# EAGLE design RGBS_to_YPbPr (EAGLE 9.6.2)
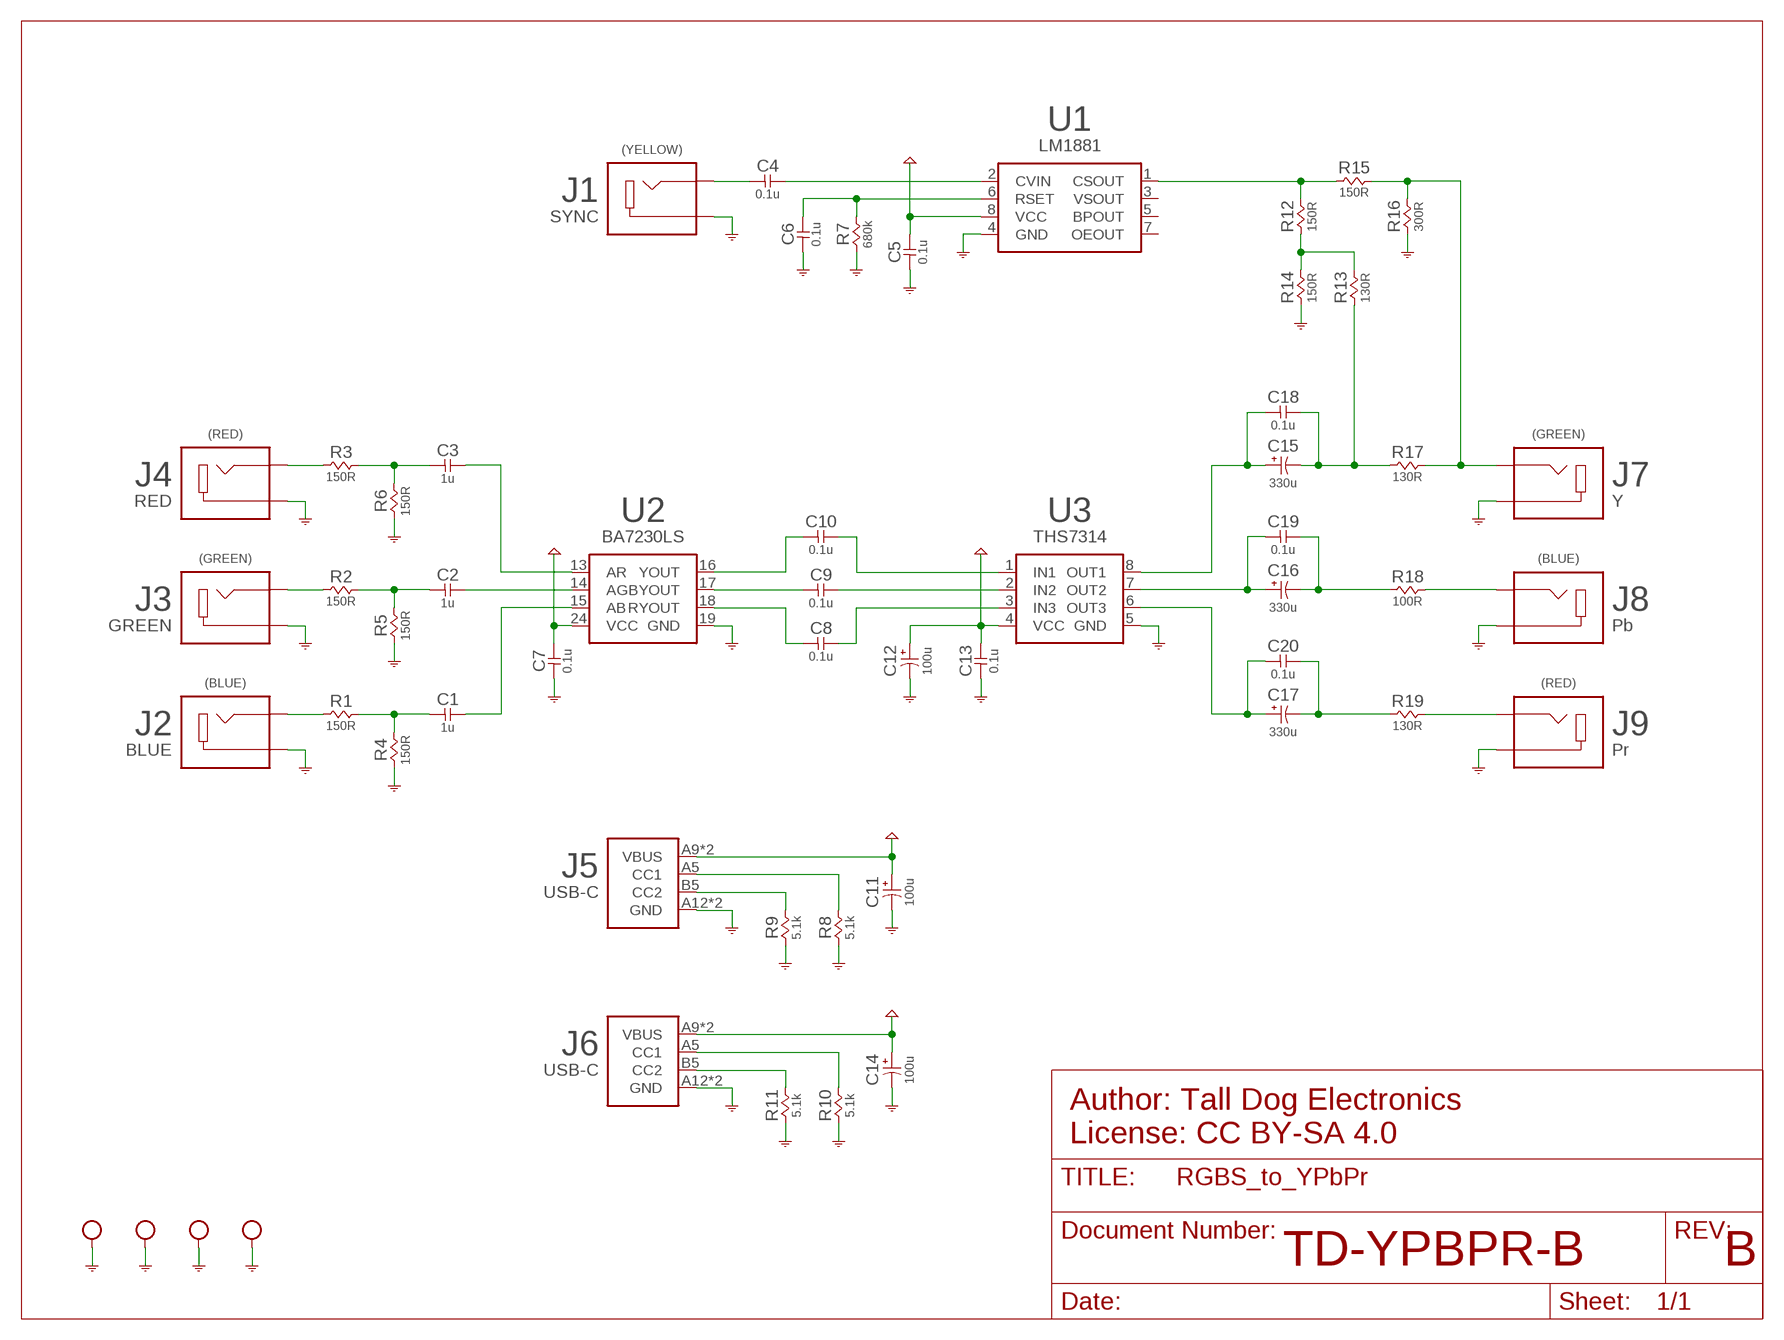
[diagram p0: schematic, sheet 1]

## Parts
C1  1u  CAP-NP-0805  [0805-NP]
C2  1u  CAP-NP-0805  [0805-NP]
C3  1u  CAP-NP-0805  [0805-NP]
C4  0.1u  CAP-NP-0805  [0805-NP]
C5  0.1u  CAP-NP-0805  [0805-NP]
C6  0.1u  CAP-NP-0805  [0805-NP]
C7  0.1u  CAP-NP-0805  [0805-NP]
C8  0.1u  CAP-NP-0805  [0805-NP]
C9  0.1u  CAP-NP-0805  [0805-NP]
C10  0.1u  CAP-NP-0805  [0805-NP]
C11  100u  CAP-P-D  [ECAP-D]
C12  100u  CAP-P-D  [ECAP-D]
C13  0.1u  CAP-NP-0805  [0805-NP]
C14  100u  CAP-P-D  [ECAP-D]
C15  330u  CAP-P-E  [ECAP-E]
C16  330u  CAP-P-E  [ECAP-E]
C17  330u  CAP-P-E  [ECAP-E]
C18  0.1u  CAP-NP-0805  [0805-NP]
C19  0.1u  CAP-NP-0805  [0805-NP]
C20  0.1u  CAP-NP-0805  [0805-NP]
HOLE1  HOLE-M2.5  [HOLE-M2.5]
HOLE2  HOLE-M2.5  [HOLE-M2.5]
HOLE3  HOLE-M2.5  [HOLE-M2.5]
HOLE4  HOLE-M2.5  [HOLE-M2.5]
J1  SYNC  JACK  [RCJ]
J2  BLUE  JACK  [RCJ]
J3  GREEN  JACK  [RCJ]
J4  RED  JACK  [RCJ]
J5  USB-C  USB-C-POWER  [USB4125]
J6  USB-C  USB-C-POWER  [USB4125]
J7  Y  JACK  [RCJ]
J8  Pb  JACK  [RCJ]
J9  Pr  JACK  [RCJ]
R1  150R  RESISTOR-0805  [0805-NP]
R2  150R  RESISTOR-0805  [0805-NP]
R3  150R  RESISTOR-0805  [0805-NP]
R4  150R  RESISTOR-0805  [0805-NP]
R5  150R  RESISTOR-0805  [0805-NP]
R6  150R  RESISTOR-0805  [0805-NP]
R7  680k  RESISTOR-0805  [0805-NP]
R8  5.1k  RESISTOR-0805  [0805-NP]
R9  5.1k  RESISTOR-0805  [0805-NP]
R10  5.1k  RESISTOR-0805  [0805-NP]
R11  5.1k  RESISTOR-0805  [0805-NP]
R12  150R  RESISTOR-0805  [0805-NP]
R13  130R  RESISTOR-0805  [0805-NP]
R14  150R  RESISTOR-0805  [0805-NP]
R15  150R  RESISTOR-0805  [0805-NP]
R16  300R  RESISTOR-0805  [0805-NP]
R17  130R  RESISTOR-0805  [0805-NP]
R18  100R  RESISTOR-0805  [0805-NP]
R19  130R  RESISTOR-0805  [0805-NP]
U1  LM1881  [SOIC-8]
U2  BA7230LS  [SZIP-24]
U3  THS7314  [SOIC-8]

## Nets
BLUE: C1.1 R1.2 R4.2
GND: C5.1 C6.1 C7.1 C11.C C12.C C13.1 C14.C HOLE1.P$1 HOLE1.P$6 HOLE1.P$7 HOLE1.P$8 HOLE1.P$9 HOLE1.P$13 HOLE1.P$14 HOLE1.P$15 HOLE1.P$16 HOLE2.P$1 HOLE2.P$6 HOLE2.P$7 HOLE2.P$8 HOLE2.P$9 HOLE2.P$13 HOLE2.P$14 HOLE2.P$15 HOLE2.P$16 HOLE3.P$1 HOLE3.P$6 HOLE3.P$7 HOLE3.P$8 HOLE3.P$9 HOLE3.P$13 HOLE3.P$14 HOLE3.P$15 HOLE3.P$16 HOLE4.P$1 HOLE4.P$6 HOLE4.P$7 HOLE4.P$8 HOLE4.P$9 HOLE4.P$13 HOLE4.P$14 HOLE4.P$15 HOLE4.P$16 J1.1B(S) J1.1T(S) J2.1B(S) J2.1T(S) J3.1B(S) J3.1T(S) J4.1B(S) J4.1T(S) J5.A12(GND) J5.B12(GND) J6.A12(GND) J6.B12(GND) J7.1B(S) J7.1T(S) J8.1B(S) J8.1T(S) J9.1B(S) J9.1T(S) R4.1 R5.1 R6.1 R7.1 R8.1 R9.1 R10.1 R11.1 R14.1 R16.1 U1.4(GND) U2.19(GND) U3.5(GND)
GREEN: C2.1 R2.2 R5.2
N$1: J7.2B(T) J7.2T(T) R15.2 R16.2 R17.2
N$2: C16.C C19.2 R18.1
N$3: C16.A C19.1 U3.7(OUT2)
N$4: C15.A C18.1 U3.8(OUT1)
N$5: C17.C C20.2 R19.1
N$6: C17.A C20.1 U3.6(OUT3)
N$7: C4.2 U1.2(CVIN)
N$8: C10.2 U3.1(IN1)
N$9: C9.2 U3.2(IN2)
N$10: C8.2 U3.3(IN3)
N$11: J6.B5(CC2) R11.2
N$12: J6.A5(CC1) R10.2
N$13: J5.B5(CC2) R9.2
N$14: J5.A5(CC1) R8.2
N$15: C8.1 U2.18(RYOUT)
N$16: J4.2B(T) J4.2T(T) R3.1
N$17: J3.2B(T) J3.2T(T) R2.1
N$18: C15.C C18.2 R13.1 R17.1
N$19: C9.1 U2.17(BYOUT)
N$20: J2.2B(T) J2.2T(T) R1.1
N$21: C10.1 U2.16(YOUT)
N$22: R12.1 R13.2 R14.2
N$23: C3.2 U2.13(AR)
N$24: C2.2 U2.14(AG)
N$25: C1.2 U2.15(AB)
N$27: C6.2 R7.2 U1.6(RSET)
PB: J8.2B(T) J8.2T(T) R18.2
PR: J9.2B(T) J9.2T(T) R19.2
RED: C3.1 R3.2 R6.2
SYNC: C4.1 J1.2B(T) J1.2T(T)
VCC: C5.2 C7.2 C11.A C12.A C13.2 C14.A J5.A9(VBUS) J5.B9(VBUS) J6.A9(VBUS) J6.B9(VBUS) U1.8(VCC) U2.24(VCC) U3.4(VCC)
Y: R12.2 R15.1 U1.1(CSOUT)
Unconnected: U1.3(VSOUT) U1.5(BPOUT) U1.7(OEOUT)

## Notes on the sheet
- (YELLOW)
- (RED) | (GREEN)
- (GREEN) | (BLUE)
- (BLUE) | (RED)
- Author: Tall Dog Electronics
  License: CC BY-SA 4.0
- TD-YPBPR-B | B

## Library data of the parts
C1-C10 C13 C18-C20 = TinyNES_Library:CAP-NP
C11 C12 C14-C17 = TinyNES_Library:CAP-P
HOLE1-HOLE4 = TinyNES_Library:HOLE
J1-J4 J7-J9 = TinyNES_Library:JACK
J5 J6 = TinyNES_Library:USB-C-POWER
R1-R19 = TinyNES_Library:RESISTOR
U1 = TinyNES_Library:LM1881
U2 = TinyNES_Library:BA7230LS
U3 = TinyNES_Library:THS7314

## Board
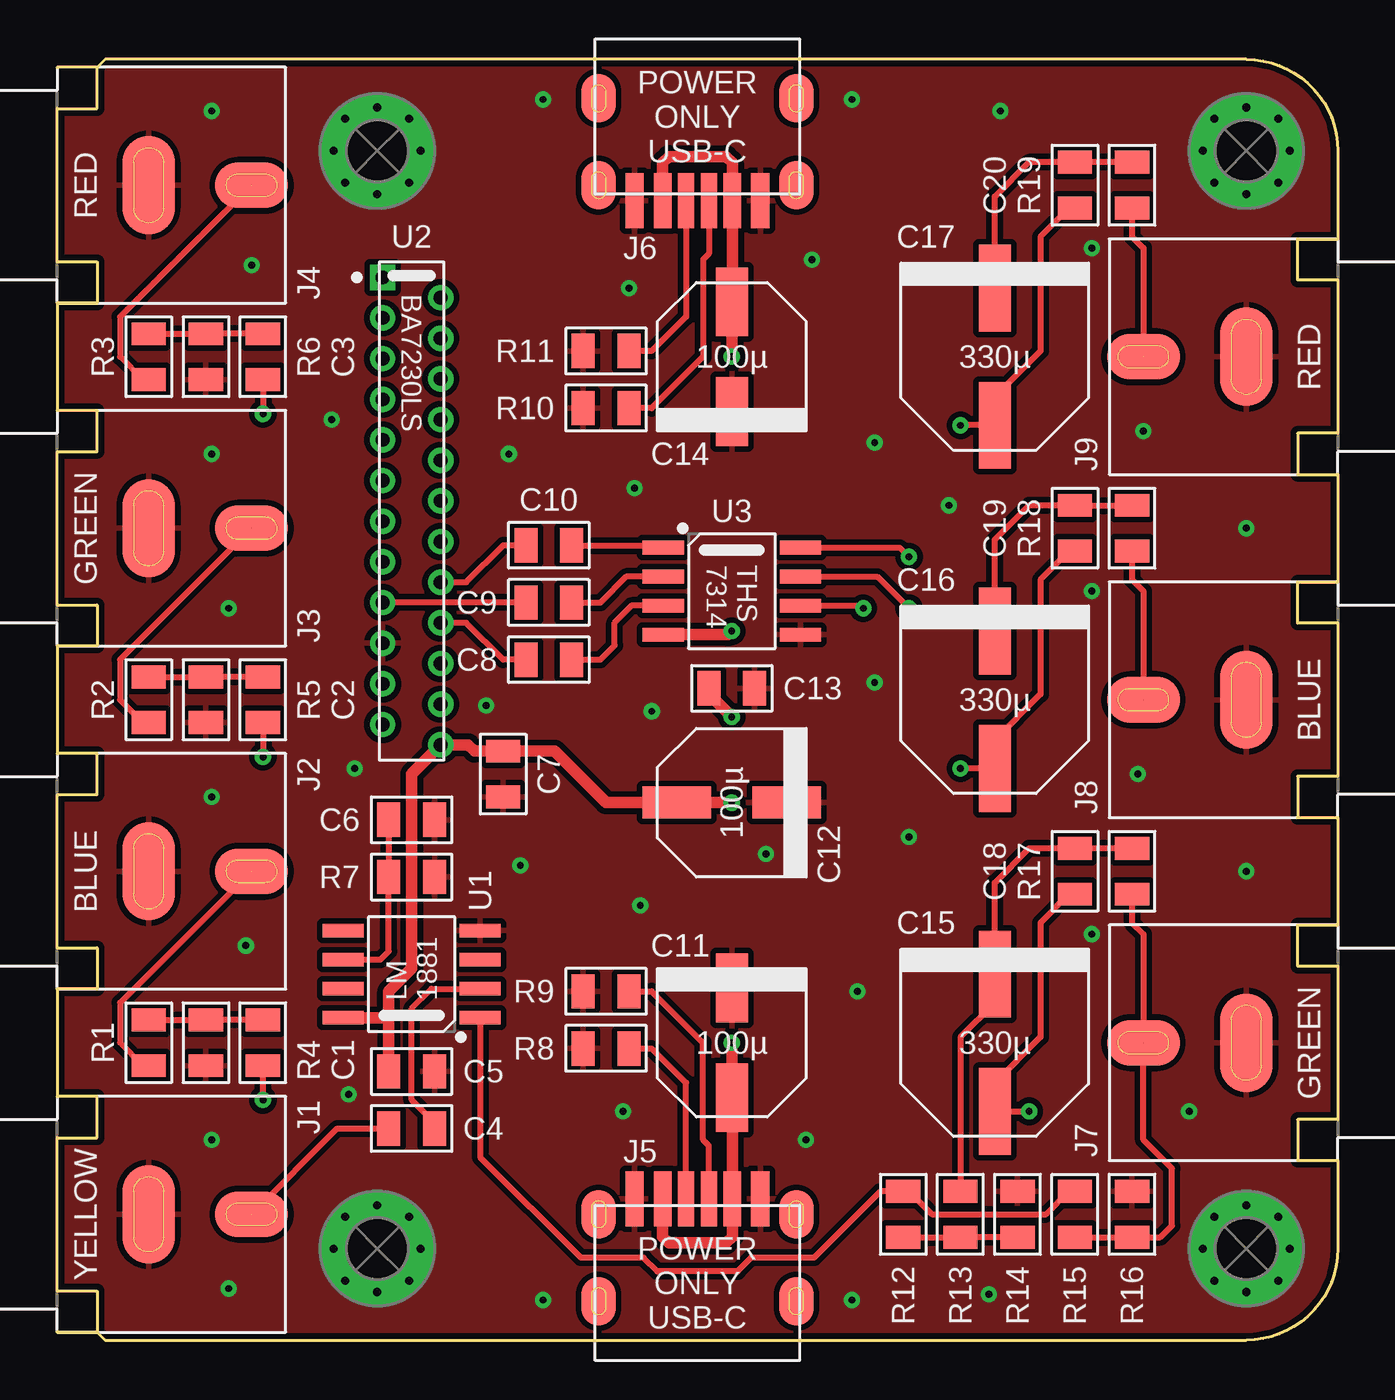
[diagram p1: board, top side]
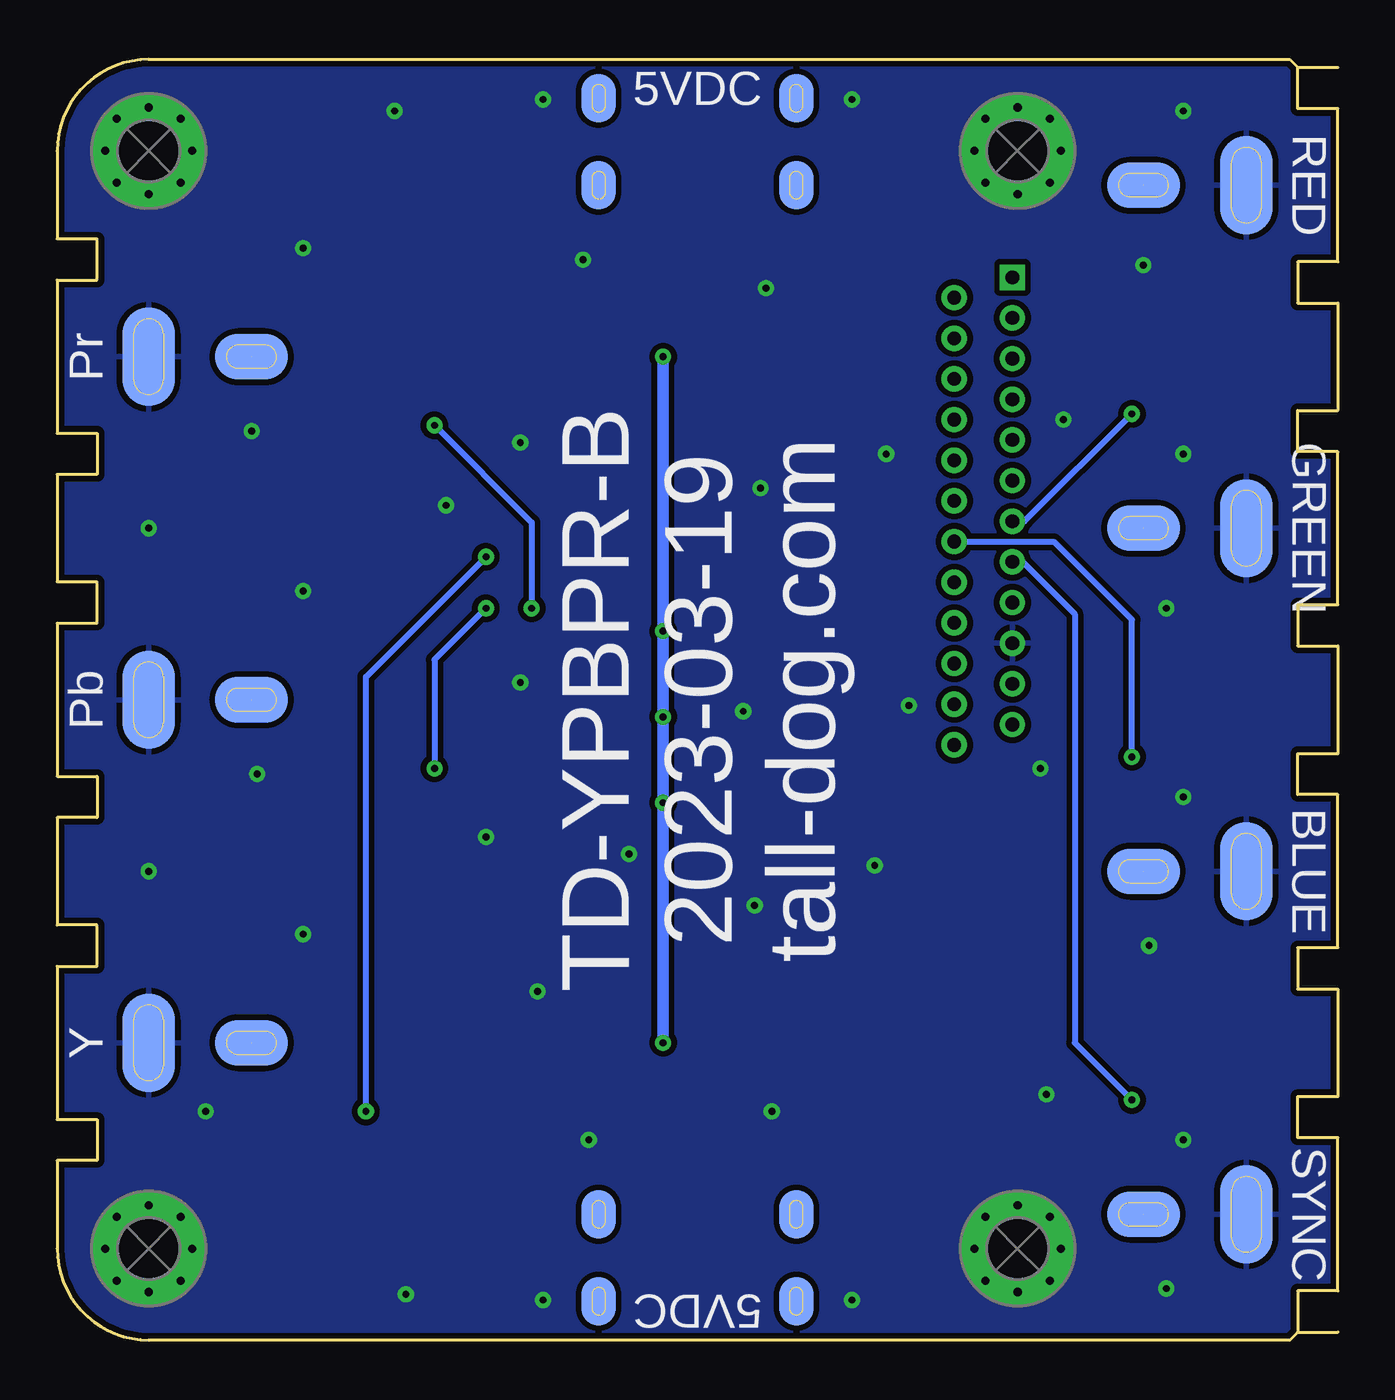
[diagram p2: board, bottom side, seen from below]

Size 56 x 56 mm. Coordinates in mm from the lower left corner, seen from the top.
Outline: 0,45.35 0,40.65
Outline: 0,30.35 0,25.65
Outline: 0,15.35 0,10.65
Outline: 56,22.85 56,18.15
Outline: 56,37.85 56,33.15
Outline: 56,48.15 56,52 arc90 52,56 2.1,56 1.75,55.65
Outline: 56,7.85 56,4 arc-90 52,0 2.1,0 1.75,0.35
Copper layers (1*16): Top 0.035mm / dielectric 1.5mm / Bottom 0.035mm
Design rules "default *": minimum track width 10mil, minimum drill 0.3mm, track to track 8mil, track to pad 8mil, pad to pad 8mil, via to via 8mil, smd to smd 8mil, copper to edge 10mil, drill to drill 10mil, minimum pad ring 10mil, minimum via ring 8mil, stop-mask expansion 0mil, vias tented up to drill 0.3mm, thermal gap 10mil

### Footprints (pad centres in the part's own frame; a part is rotated, then mirrored left to right if it is on the bottom)
0805-NP = smd 1 x 1.5: 1 -1,0; 2 1,0
ECAP-D = smd 3 x 1.4: A 2.4,0; C -2.4,0
ECAP-E = smd 3.8 x 1.4: A 3,0; C -3,0
HOLE-M2.5 = drill 2.7 pad 5: P$1 0,0 | drill 0.35: P$6 1.4,1.4; P$7 1.9,0; P$8 1.4,-1.4; P$9 -1.4,-1.4; P$13 0,-1.9; P$14 -1.4,1.4; P$15 -1.9,0; P$16 0,1.9
RCJ = smd 2.3 x 4.3 bottom: 1B -4,0 | smd 2.3 x 4.3: 1T -4,0 | smd 3.2 x 2 bottom: 2B -8.5,0 | smd 3.2 x 2: 2T -8.5,0
USB4125 = smd 0.7 x 2.4: A5 -0.5,3.68; B5 0.5,3.68 | smd 0.76 x 2.4: A9 1.52,3.68; B9 -1.52,3.68 | smd 0.8 x 2.4: A12 2.75,3.68; B12 -2.75,3.68 | smd 1.5 x 2.1 bottom: S1B -4.32,3; S2B 4.32,3; S3B -4.32,-0.8; S4B 4.32,-0.8 | smd 1.5 x 2.1: S1T -4.32,3; S2T 4.32,3; S3T -4.32,-0.8; S4T 4.32,-0.8
SOIC-8 = smd 0.6 x 1.8: 1 -1.905,-3; 2 -0.635,-3; 3 0.635,-3; 4 1.905,-3; 5 1.905,3; 6 0.635,3; 7 -0.635,3; 8 -1.905,3
SZIP-24 = drill 0.6 square: 1 -10.223,-1.27 | drill 0.6: 2 -9.335,1.27; 3 -8.445,-1.27; 4 -7.556,1.27; 5 -6.668,-1.27; 6 -5.779,1.27; 7 -4.889,-1.27; 8 -4,1.27; 9 -3.111,-1.27; 10 -2.223,1.27; 11 -1.333,-1.27; 12 -0.445,1.27; 13 0.445,-1.27; 14 1.333,1.27; 15 2.223,-1.27; 16 3.111,1.27; 17 4,-1.27; 18 4.889,1.27; 19 5.779,-1.27; 20 6.668,1.27; 21 7.556,-1.27; 22 8.445,1.27; 23 9.335,-1.27; 24 10.223,1.27

### Placement (x,y rotation side)
C1  9,13 270 top
C2  9,28 270 top
C3  9,43 270 top
C4  15.5,9.25 0 top
C5  15.5,11.75 180 top
C6  15.5,22.75 180 top
C7  19.5,24.75 90 top
C8  21.5,29.75 0 top
C9  21.5,32.25 0 top
C10  21.5,34.75 0 top
C11  29.5,13 270 top
C12  29.5,23.5 180 top
C13  29.5,28.5 180 top
C14  29.5,43 90 top
C15  41,13 270 top
C16  41,28 270 top
C17  41,43 270 top
C18  44.5,20.5 90 top
C19  44.5,35.5 90 top
C20  44.5,50.5 90 top
HOLE1  14,4 0 top
HOLE2  14,52 0 top
HOLE3  52,4 0 top
HOLE4  52,52 0 top
J1  0,5.5 180 top
J2  0,20.5 180 top
J3  0,35.5 180 top
J4  0,50.5 180 top
J5  28,2.5 0 top
J6  28,53.5 180 top
J7  56,13 0 top
J8  56,28 0 top
J9  56,43 0 top
R1  4,13 90 top
R2  4,28 90 top
R3  4,43 90 top
R4  6.5,13 90 top
R5  6.5,28 90 top
R6  6.5,43 90 top
R7  15.5,20.25 180 top
R8  24,12.75 0 top
R9  24,15.25 0 top
R10  24,40.75 0 top
R11  24,43.25 0 top
R12  37,5.5 90 top
R13  39.5,5.5 270 top
R14  42,5.5 270 top
R15  44.5,5.5 270 top
R16  47,5.5 270 top
R17  47,20.5 270 top
R18  47,35.5 270 top
R19  47,50.5 270 top
U1  15.5,16 90 top
U2  15.5,36.25 270 top
U3  29.5,32.75 270 top

### Tracks (layer width: path | path; a pad name or v marks a point on that pad's centre or on a via)
BLUE
  Top 0.254: C1.1 R4.2 R1.2
GND  (via drill 0.3)
  other vias: 35.75,39.25 39,36.5 33,47.25 25,46 24.75,10 32.75,8.75 20.25,20.75 37.25,22 26,27.5 35.75,28.75 18.75,27.75 6.75,8.75 6.75,23.75 6.75,38.75 6.75,53.75 8.5,47 7.5,32 8.25,17.25 7.5,2.25 52,20.5 52,35.5 47.25,24.75 49.5,10 47.5,39.75 41.25,53.75 45.25,47.75 45.25,32.75 45.25,17.75 40.75,2 35,15.25 25.25,37.25 19.75,38.75 12,40.25 13,25 12.75,10.75 25.5,19 31,21.25 21.25,54.25 34.75,54.25 34.75,1.75 21.25,1.75
  pour Top (isolate 0.25): 0,56 56,56 56,0 0,0
  pour Bottom (isolate 0.25): 0,56 56,56 56,0 0,0
GREEN
  Top 0.254: C2.1 R5.2 R2.2
N$1  (1 unrouted)
  Top 0.254: R17.2 47,18.25 47.5,17.75 J7.2T 47.5,8.75 48.75,7.5 48.75,5 48.25,4.5 R16.2 R15.2
N$2
  Top 0.254: R18.1 C19.2 42.5,36.5 41,35 C16.C
N$3  (via drill 0.3)
  Top 0.254: C19.1 44.25,34.5 43,33.25 43,28.25 41,26.25 C16.A v39.5,25 | U3.7 35.87,33.38 v37.25,32
  Bottom 0.254: v37.25,32 39.5,29.75 v39.5,25
N$4  (via drill 0.3)
  Top 0.254: C18.1 44.25,19.5 43,18.25 43,13.25 41,11.25 C15.A v42.5,10 | U3.8 36.84,34.66 v37.25,34.25
  Bottom 0.254: v42.5,10 42.5,29 v37.25,34.25
N$5
  Top 0.254: R19.1 C20.2 42.5,51.5 41,50 C17.C
N$6  (via drill 0.3)
  Top 0.254: C20.1 44.25,49.5 43,48.25 43,43.25 41,41.25 C17.A v39.5,40 | U3.6 35.13,32.12 v35.25,32
  Bottom 0.254: v35.25,32 35.25,35.75 v39.5,40
N$7
  Top 0.254: C4.2 16.5,9.5 15.5,10.5 15.5,14.5 16.36,15.37 U1.2
N$8
  Top 0.254: C10.2 26.5,34.75 U3.1
N$9
  Top 0.254: C9.2 23.75,32.25 24.89,33.38 U3.2
N$10
  Top 0.254: U3.3 25.11,32.12 24.38,31.38 24.38,30.38 23.75,29.75 C8.2
N$11
  Top 0.254: J6.B5 27.5,44.75 26,43.25 R11.2
N$12
  Top 0.254: J6.A5 28.5,47.5 28.25,47.25 28.25,43 26,40.75 R10.2
N$13
  Top 0.254: J5.B5 28.5,8.5 28.25,8.75 28.25,13 26,15.25 R9.2
N$14
  Top 0.254: J5.A5 27.5,11.25 26,12.75 R8.2
N$15
  Top 0.254: C8.1 19.5,29.75 17.89,31.36 U2.18
N$16  (1 unrouted)
  Top 0.254: R3.1 3.75,42 2.75,43 2.75,44.75 J4.2T
N$17  (1 unrouted)
  Top 0.254: R2.1 3.75,27 2.75,28 2.75,29.75 J3.2T
N$18
  Top 0.254: R17.1 C18.2 42.5,21.5 41,20 C15.C 41,14.75 39.5,13.25 R13.1
N$19
  Top 0.254: C9.1 U2.17
N$20  (1 unrouted)
  Top 0.254: R1.1 3.75,12 2.75,13 2.75,14.75 J2.2T
N$21
  Top 0.254: U2.16 17.89,33.14 19.5,34.75 C10.1
N$22
  Top 0.254: R14.2 R13.2 R12.1
N$23  (via drill 0.3)
  Top 0.254: C3.2 v9,40.5
  Bottom 0.254: v9,40.5 13.69,35.81 U2.13
N$24  (via drill 0.3)
  Top 0.254: C2.2 v9,25.5
  Bottom 0.254: U2.14 12.42,34.92 9,31.5 v9,25.5
N$25  (via drill 0.3)
  Top 0.254: v9,10.5 C1.2
  Bottom 0.254: U2.15 13.78,34.03 11.5,31.75 11.5,13 v9,10.5
N$27
  Top 0.254: C6.2 R7.2 14.5,17 14.13,16.64 U1.6
PB  (1 unrouted)
  Top 0.254: R18.2 47,33.25 47.5,32.75 J8.2T
PR  (1 unrouted)
  Top 0.254: R19.2 47,48.25 47.5,47.75 J9.2T
RED
  Top 0.254: C3.1 R6.2 R3.2
SYNC  (1 unrouted)
  Top 0.254: 8.5,5.75 J1.2T 12.25,9.25 C4.1
VCC  (via drill 0.3)
  Top 0.254: 29.52,10.58 C11.A | 29.52,45.42 C14.A
  Top 0.508: U3.4 29.34,30.84 v29.5,31 | 29.52,10.58 J5.A9 29.52,4.52 29.25,4.25 26.75,4.25 26.48,4.52 J5.B9 | 29.52,45.42 J6.B9 29.52,51.48 29.25,51.75 26.75,51.75 26.48,51.48 J6.A9 | C11.A v29.5,13 | v29.5,23.5 C12.A 24,23.5 21.75,25.75 C7.2 18.25,25.75 17.97,26.03 U2.24 15.5,24.76 15.5,16.25 14.5,15.25 14.5,14.1 | C14.A v29.5,43 | v29.5,27.25 28.5,28.25 C13.2 | U1.8 14.5,14.1 | 14.5,14.1 C5.2
  Bottom 0.508: v29.5,13 v29.5,23.5 v29.5,27.25 v29.5,31 v29.5,43
Y
  Top 0.254: R15.1 44.25,6.5 43.25,5.5 38.25,5.5 37.25,6.5 R12.2 36,6.5 33.1,3.6 30.35,3.6 29.75,3 26.25,3 25.65,3.6 22.9,3.6 18.5,8 U1.1

### Text on the board
tPlace: POWER / ONLY / USB-C | RED | BA7230LS | 100µ | 330µ | RED | GREEN | THS / 7314 | 330µ | BLUE | 100µ | BLUE | LM / 1881 | 100µ | 330µ | GREEN | YELLOW | POWER / ONLY / USB-C
bPlace: 5VDC | RED | Pr | GREEN | TD-YPBPR-B / 2023-03-19 / tall-dog.com | Pb | BLUE | Y | SYNC | 5VDC
tDocu: (RED) | (RED) | (GREEN) | (BLUE) | (BLUE) | (GREEN) | (YELLOW)